# EasyEDA schematic schematic_eda.json
TITLE: Shed Lock; REV: 1.0; Date: 2024-04-02; Sheet: 1/1; Drawn By: quintindunn; Company: https://github.com/quintindunn
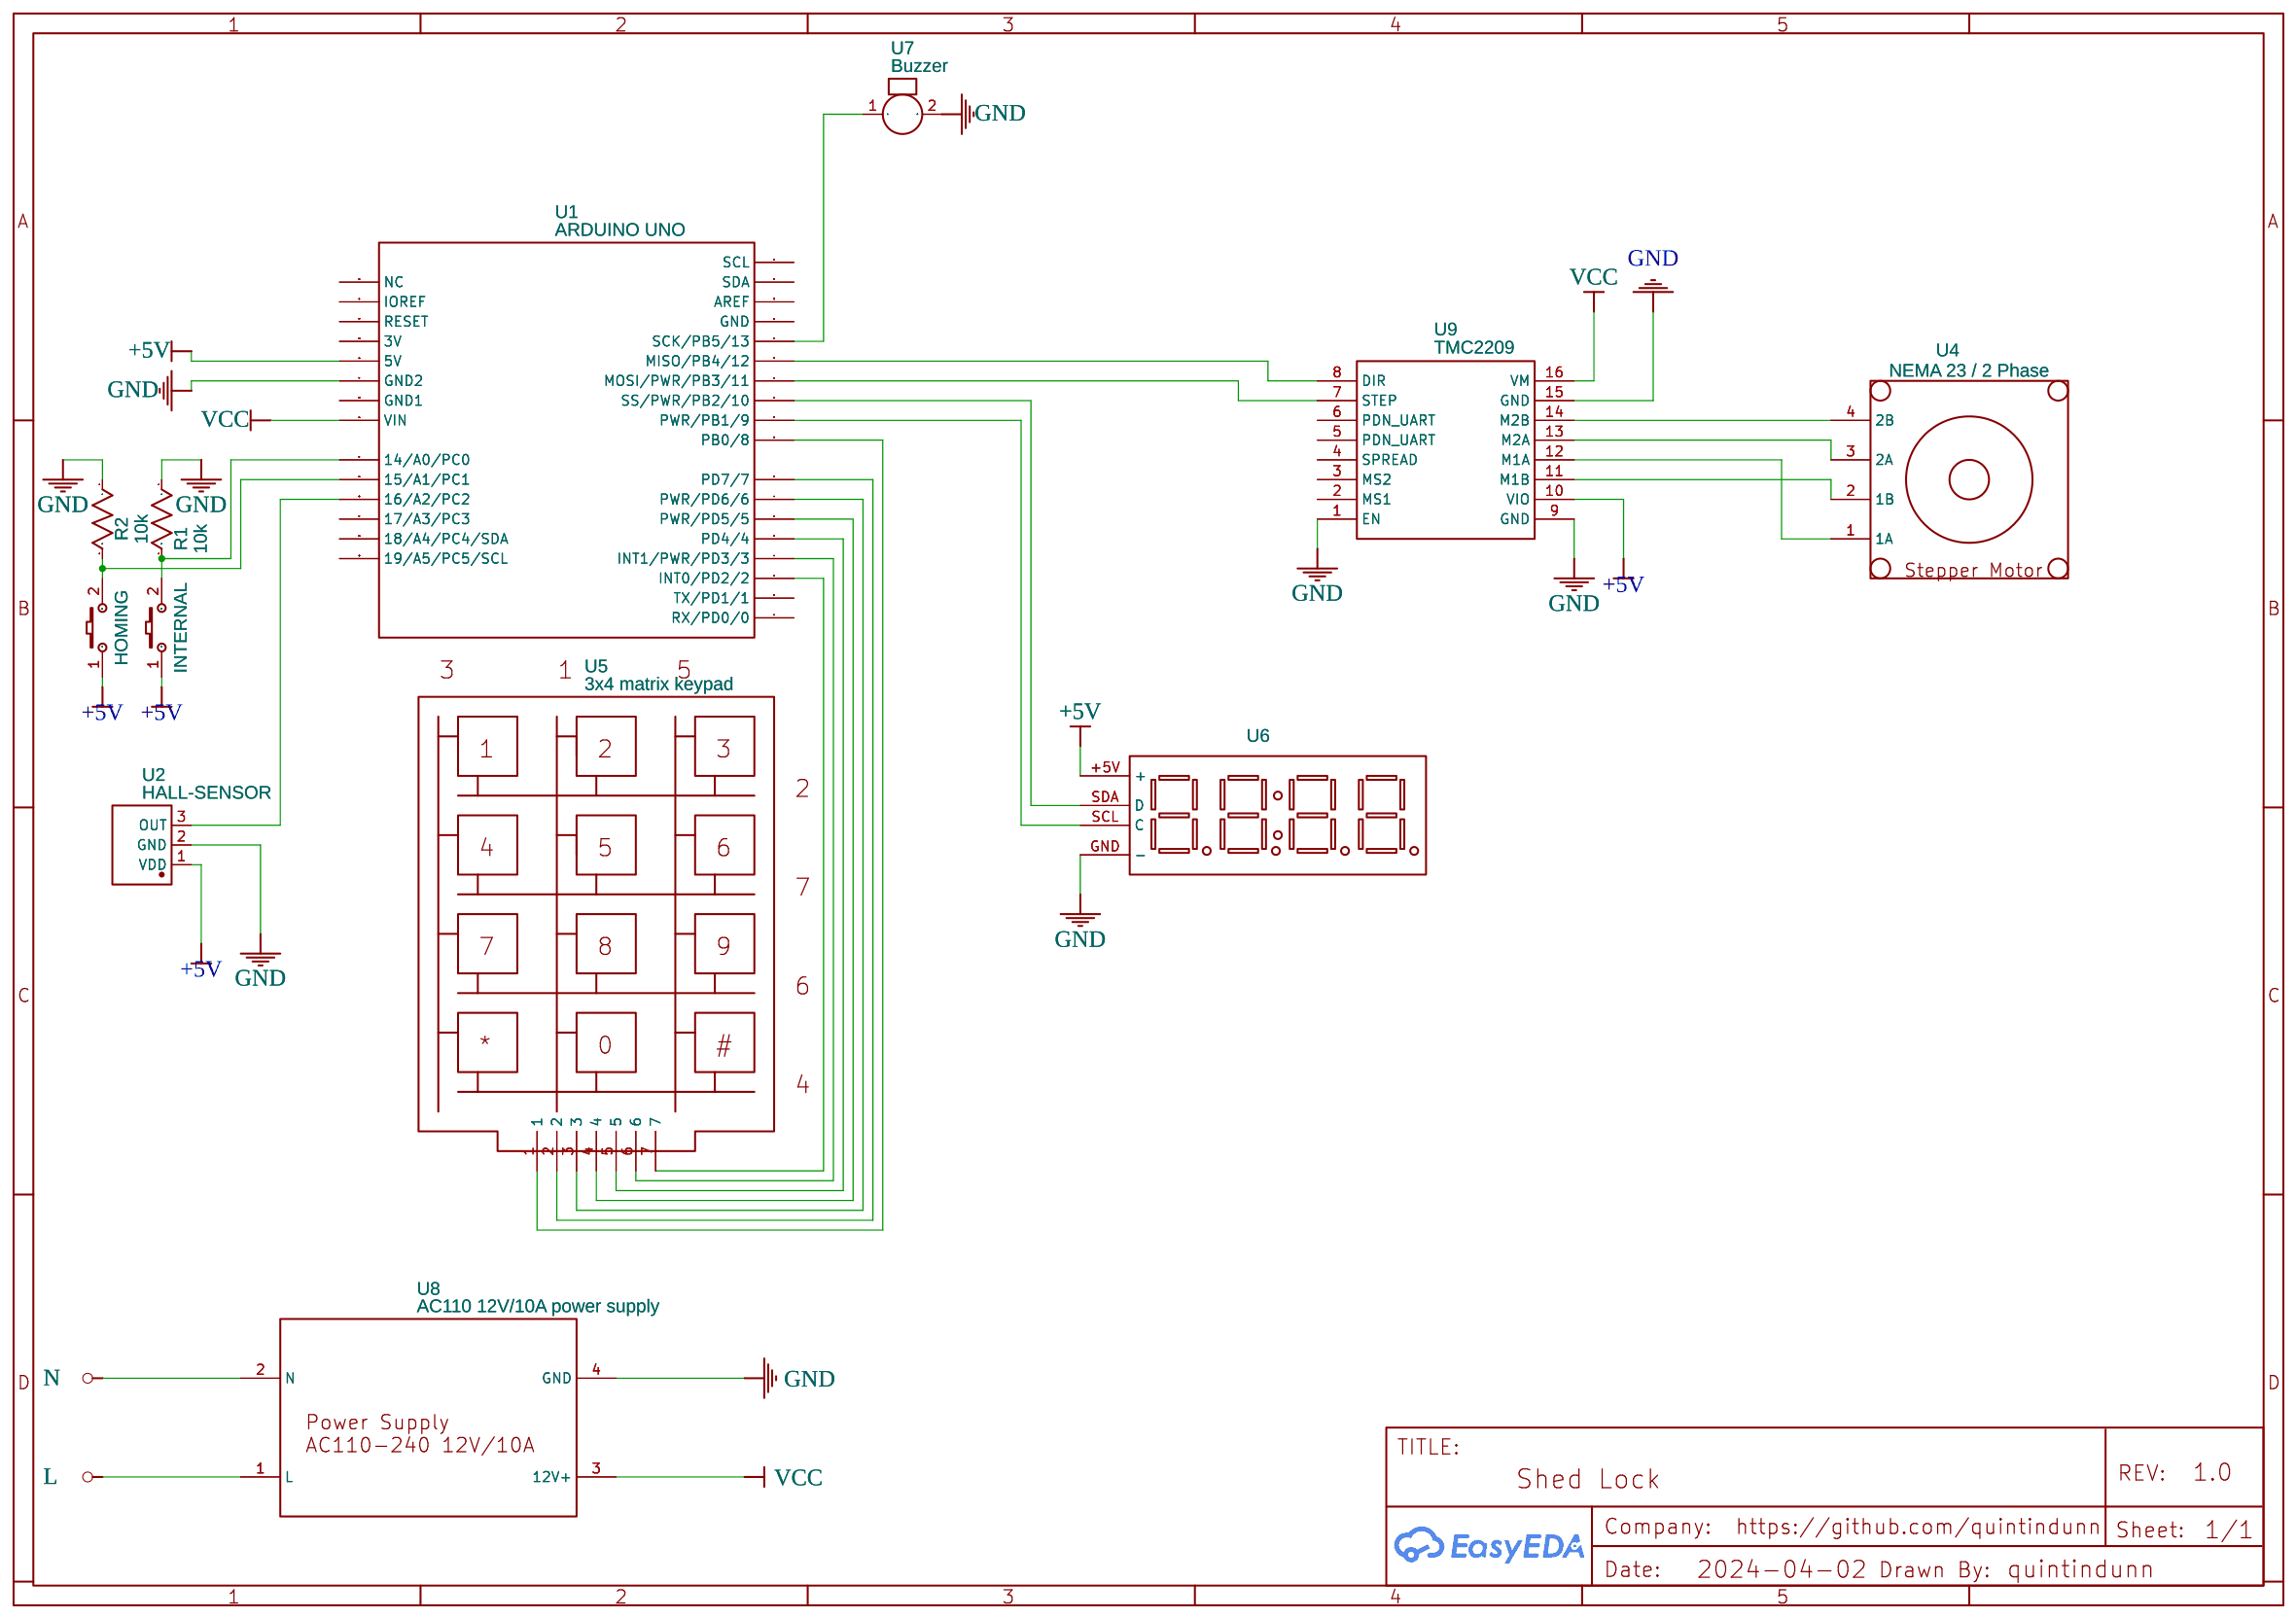
[diagram p0: schematic sheet]

## Parts
HOMING  K2-3.6×6.1_SMD  [KEY-SMD_2P-L6.2-W3.6-LS8.0]
INTERNAL  K2-3.6×6.1_SMD  [KEY-SMD_2P-L6.2-W3.6-LS8.0]
R1  10k  [R0603]
R2  10k  [R0603]
U1  ARDUINO UNO  [UNO_R3;WO ARDUINO UNO]
U2  HALL-SENSOR  [HALL-SENSOR-US5881-ZA]
U4  NEMA 23 / 2 Phase
U5  3x4 matrix keypad  [3X4 MATRIX KEYPAD]
U6  ADAFRUIT 4-DIGIT 7-SEGMENT DISPLAY WITH I2C BACKPACK  [7-SEGMENT BACKPACK]
U7  Buzzer  [BUZZER]
U8  AC110 12V/10A power supply
U9  TMC2209  [TMC2209]

## Library data of the parts
HOMING INTERNAL = K2-3.6×6.1_SMD: Supplier Part: C118141; Supplier: LCSC; Manufacturer Part: K2-1107ST-A4SW-06; Contributor: LCEDA_Lib; 制造商: 韩国韩荣
R1 R2 = R_0603_US: Contributor: LCEDA_Lib
U1 = ARDUINO UNO: Contributor: sberkhimer; sourceId: frlCUcuMG
U2 = HALL-SENSOR-US5881-ZA: Supplier: LCSC; Supplier Part: C1526823; Manufacturer: Melexis(比利时迈来芯); Manufacturer Part: US5881EUA-AAA-000-BU; Contributor: zainul.aabdin
U4 = Stepper Motor: Bipolar, 200 Steps/Rev, 3.2V, 2.8 A/Phase: Contributor: Damien_G
U5 = 3x4 matrix keypad: Supplier: sunrom; Supplier Part: 6039; link: https://www.sunrom.com/p/3x4-soft-touch-matrix-keypad-module; Contributor: raja1
U6 = ADAFRUIT 4-DIGIT 7-SEGMENT DISPLAY WITH I2C BACKPACK: Adafruit 7-Segment LED I2C Backpack
U7 = Buzzer: Contributor: mkur
U8 = AC110 12V/2A power supply: Contributor: jasonboy99
U9 = TMC2209: Contributor: nclin941

## Nets
+5V: HOMING.1 INTERNAL.1 U1.28(5V) U2.1(VDD) U6.+5V(+) U9.10(VIO)
GND: R1.1 R2.1 U1.27(GND2) U2.2(GND) U6.GND(-) U7.2 U8.4(GND) U9.1(EN) U9.9(GND) U9.15(GND)
VCC: U1.25(VIN) U8.3(12V+) U9.16(VM)
L: U8.1(L)
N: U8.2(N)
Net-(HOMING-2): HOMING.2 R2.2 U1.23(15/A1/PC1)
Net-(INTERNAL-2): INTERNAL.2 R1.2 U1.24(14/A0/PC0)
Net-(U1-3): U1.3(INT0/PD2/2) U5.7
Net-(U1-4): U1.4(INT1/PWR/PD3/3) U5.6
Net-(U1-5): U1.5(PD4/4) U5.5
Net-(U1-6): U1.6(PWR/PD5/5) U5.4
Net-(U1-7): U1.7(PWR/PD6/6) U5.3
Net-(U1-8): U1.8(PD7/7) U5.2
Net-(U1-9): U1.9(PB0/8) U5.1
Net-(U1-10): U1.10(PWR/PB1/9) U6.SCL(C)
Net-(U1-11): U1.11(SS/PWR/PB2/10) U6.SDA(D)
Net-(U1-12): U1.12(MOSI/PWR/PB3/11) U9.7(STEP)
Net-(U1-13): U1.13(MISO/PB4/12) U9.8(DIR)
Net-(U1-14): U1.14(SCK/PB5/13) U7.1
Net-(U1-22): U1.22(16/A2/PC2) U2.3(OUT)
Net-(U4-1): U4.1(1A) U9.12(M1A)
Net-(U4-2): U4.2(1B) U9.11(M1B)
Net-(U4-3): U4.3(2A) U9.13(M2A)
Net-(U4-4): U4.4(2B) U9.14(M2B)

Not connected (* = marked no-connect by the designer): U1 1(RX/PD0/0) 2(TX/PD1/1) 15(GND) 16(AREF) 17(SDA) 18(SCL) 19(19/A5/PC5/SCL) 20(18/A4/PC4/SDA) 21(17/A3/PC3) 26(GND1) 29(3V) 30(RESET) 31(IOREF) 32(NC); U9 2(MS1) 3(MS2) 4(SPREAD) 5(PDN_UART) 6(PDN_UART)
